# Altium schematic sheet MatrixDriver.SchDoc
size A3
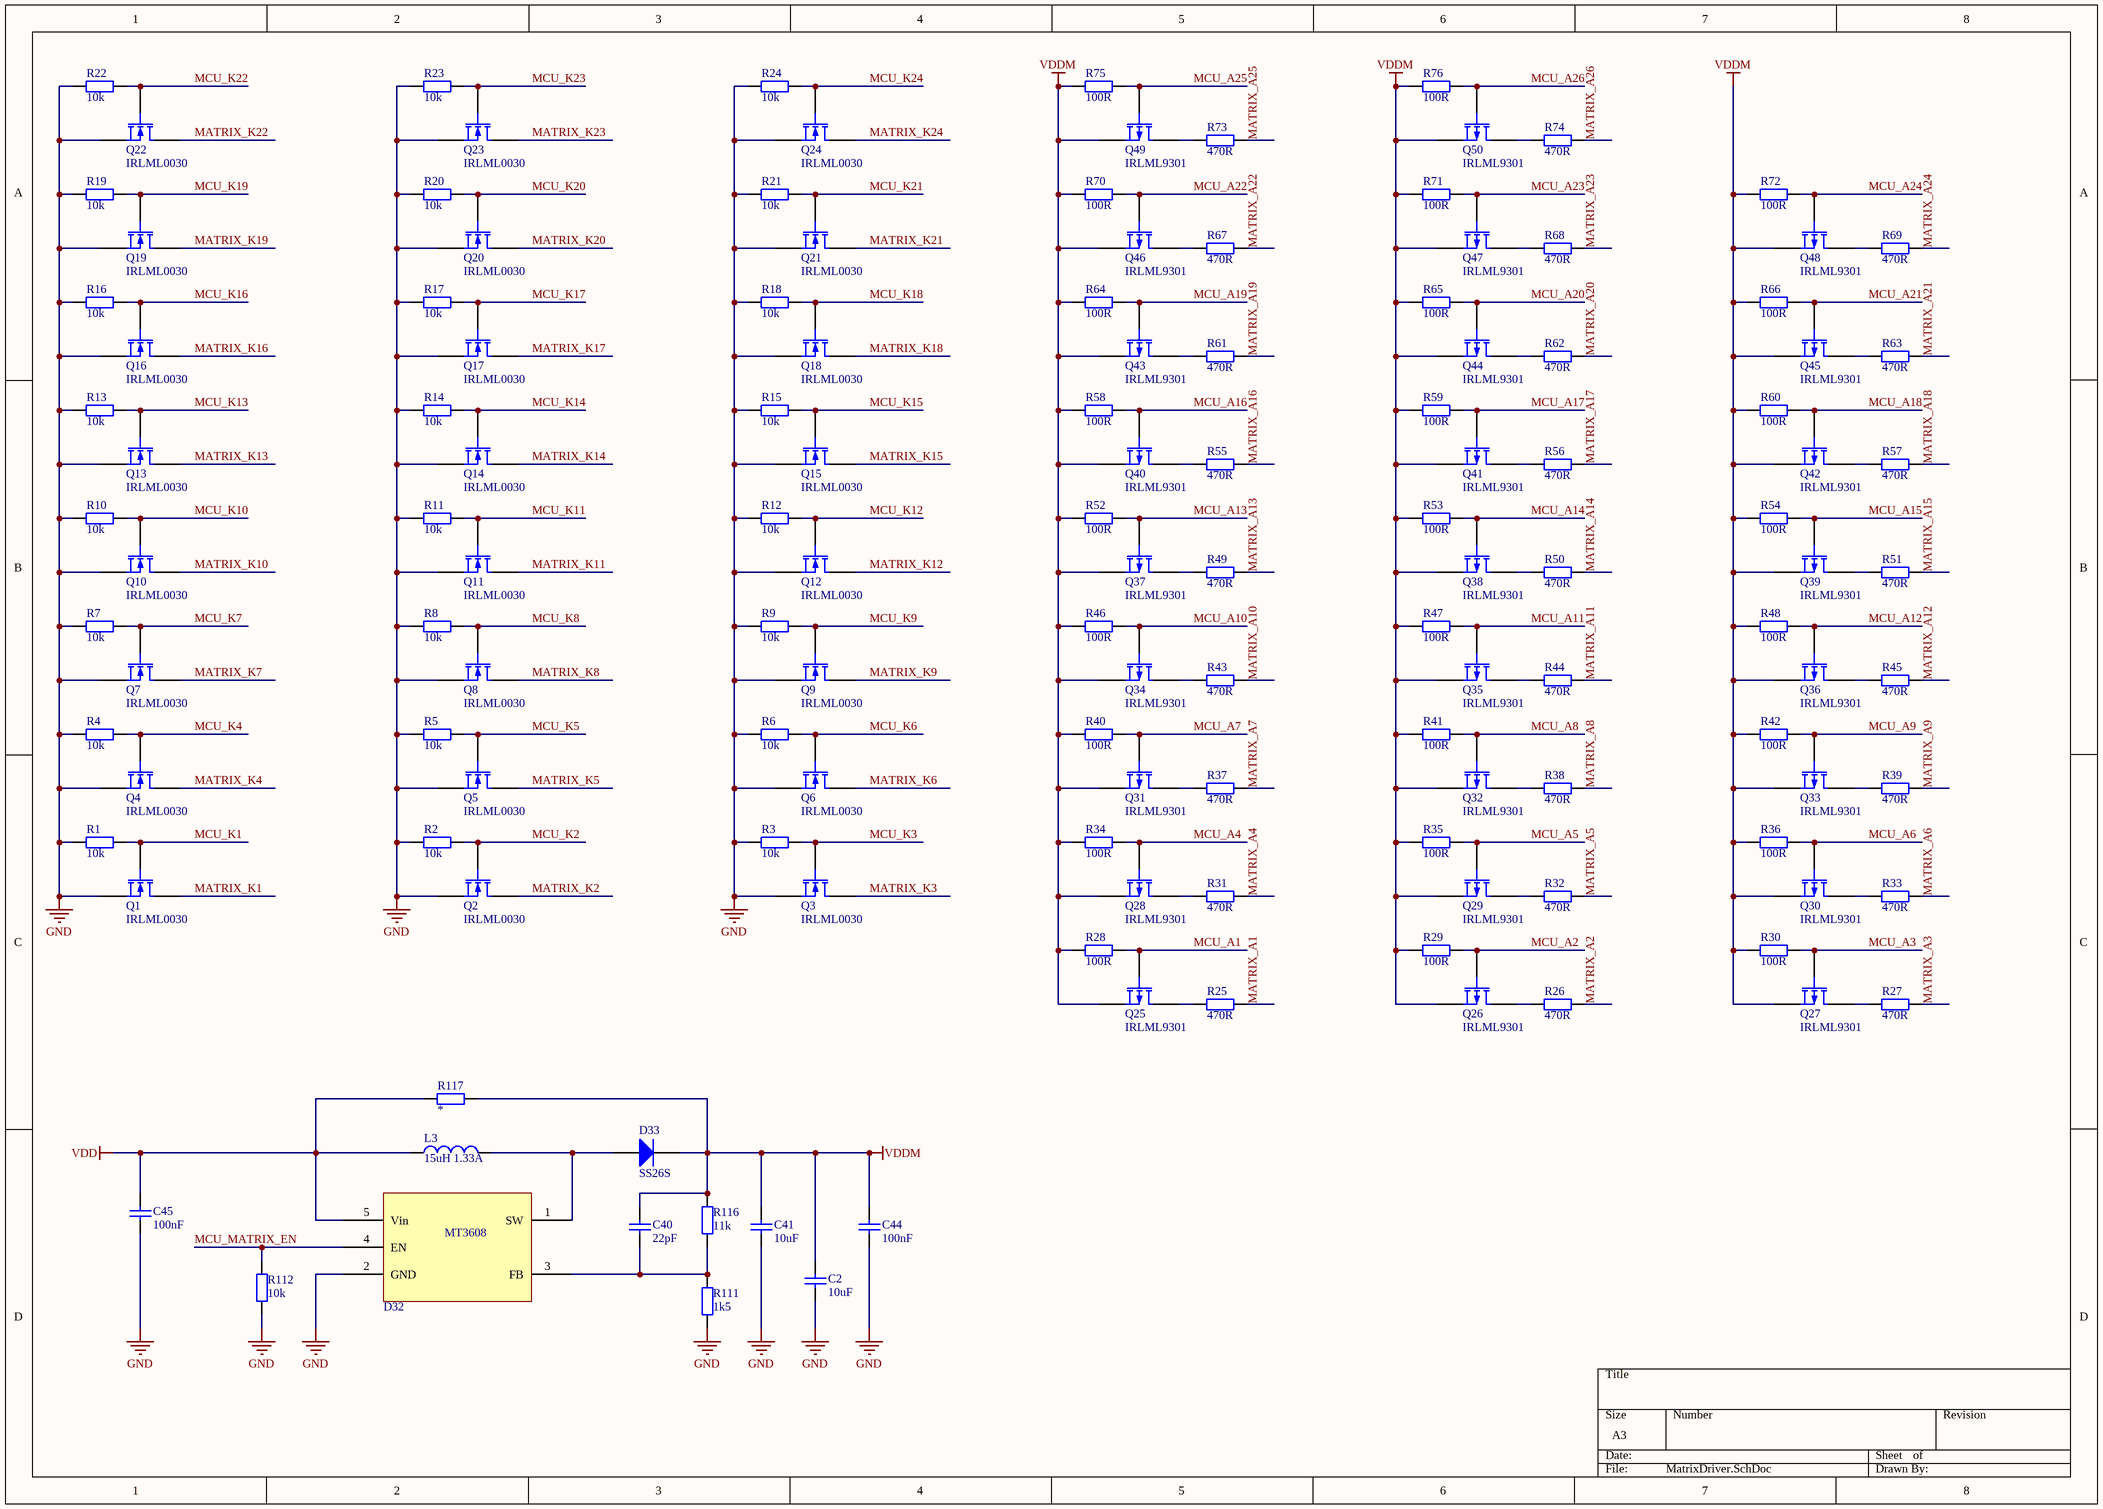
[diagram p0: MatrixDriver.SchDoc]

## Parts
C2  value 10uF  [c1206]  (hidden comment: Cap)
C40  value 22pF  [C0603]  (hidden comment: Cap)
C41  value 10uF  [c1206]  (hidden comment: Cap)
C44  value 100nF  [C0603]  (hidden comment: Cap)
C45  value 100nF  [C0603]  (hidden comment: Cap)
D32  MT3608  [SOT23-6_L]
D33  SS26S  [DO-214AB]
L3  value 15uH 1.33A  [DE0703]  (hidden comment: DE0703-15)
Q1  IRLML0030  [sot23]
Q2  IRLML0030  [sot23]
Q3  IRLML0030  [sot23]
Q4  IRLML0030  [sot23]
Q5  IRLML0030  [sot23]
Q6  IRLML0030  [sot23]
Q7  IRLML0030  [sot23]
Q8  IRLML0030  [sot23]
Q9  IRLML0030  [sot23]
Q10  IRLML0030  [sot23]
Q11  IRLML0030  [sot23]
Q12  IRLML0030  [sot23]
Q13  IRLML0030  [sot23]
Q14  IRLML0030  [sot23]
Q15  IRLML0030  [sot23]
Q16  IRLML0030  [sot23]
Q17  IRLML0030  [sot23]
Q18  IRLML0030  [sot23]
Q19  IRLML0030  [sot23]
Q20  IRLML0030  [sot23]
Q21  IRLML0030  [sot23]
Q22  IRLML0030  [sot23]
Q23  IRLML0030  [sot23]
Q24  IRLML0030  [sot23]
Q25  IRLML9301  [sot23]
Q26  IRLML9301  [sot23]
Q27  IRLML9301  [sot23]
Q28  IRLML9301  [sot23]
Q29  IRLML9301  [sot23]
Q30  IRLML9301  [sot23]
Q31  IRLML9301  [sot23]
Q32  IRLML9301  [sot23]
Q33  IRLML9301  [sot23]
Q34  IRLML9301  [sot23]
Q35  IRLML9301  [sot23]
Q36  IRLML9301  [sot23]
Q37  IRLML9301  [sot23]
Q38  IRLML9301  [sot23]
Q39  IRLML9301  [sot23]
Q40  IRLML9301  [sot23]
Q41  IRLML9301  [sot23]
Q42  IRLML9301  [sot23]
Q43  IRLML9301  [sot23]
Q44  IRLML9301  [sot23]
Q45  IRLML9301  [sot23]
Q46  IRLML9301  [sot23]
Q47  IRLML9301  [sot23]
Q48  IRLML9301  [sot23]
Q49  IRLML9301  [sot23]
Q50  IRLML9301  [sot23]
R1  value 10k  [r0603]  (hidden comment: Resistor)
R2  value 10k  [r0603]  (hidden comment: Resistor)
R3  value 10k  [r0603]  (hidden comment: Resistor)
R4  value 10k  [r0603]  (hidden comment: Resistor)
R5  value 10k  [r0603]  (hidden comment: Resistor)
R6  value 10k  [r0603]  (hidden comment: Resistor)
R7  value 10k  [r0603]  (hidden comment: Resistor)
R8  value 10k  [r0603]  (hidden comment: Resistor)
R9  value 10k  [r0603]  (hidden comment: Resistor)
R10  value 10k  [r0603]  (hidden comment: Resistor)
R11  value 10k  [r0603]  (hidden comment: Resistor)
R12  value 10k  [r0603]  (hidden comment: Resistor)
R13  value 10k  [r0603]  (hidden comment: Resistor)
R14  value 10k  [r0603]  (hidden comment: Resistor)
R15  value 10k  [r0603]  (hidden comment: Resistor)
R16  value 10k  [r0603]  (hidden comment: Resistor)
R17  value 10k  [r0603]  (hidden comment: Resistor)
R18  value 10k  [r0603]  (hidden comment: Resistor)
R19  value 10k  [r0603]  (hidden comment: Resistor)
R20  value 10k  [r0603]  (hidden comment: Resistor)
R21  value 10k  [r0603]  (hidden comment: Resistor)
R22  value 10k  [r0603]  (hidden comment: Resistor)
R23  value 10k  [r0603]  (hidden comment: Resistor)
R24  value 10k  [r0603]  (hidden comment: Resistor)
R25  value 470R  [r0603]  (hidden comment: Resistor)
R26  value 470R  [r0603]  (hidden comment: Resistor)
R27  value 470R  [r0603]  (hidden comment: Resistor)
R28  value 100R  [r0603]  (hidden comment: Resistor)
R29  value 100R  [r0603]  (hidden comment: Resistor)
R30  value 100R  [r0603]  (hidden comment: Resistor)
R31  value 470R  [r0603]  (hidden comment: Resistor)
R32  value 470R  [r0603]  (hidden comment: Resistor)
R33  value 470R  [r0603]  (hidden comment: Resistor)
R34  value 100R  [r0603]  (hidden comment: Resistor)
R35  value 100R  [r0603]  (hidden comment: Resistor)
R36  value 100R  [r0603]  (hidden comment: Resistor)
R37  value 470R  [r0603]  (hidden comment: Resistor)
R38  value 470R  [r0603]  (hidden comment: Resistor)
R39  value 470R  [r0603]  (hidden comment: Resistor)
R40  value 100R  [r0603]  (hidden comment: Resistor)
R41  value 100R  [r0603]  (hidden comment: Resistor)
R42  value 100R  [r0603]  (hidden comment: Resistor)
R43  value 470R  [r0603]  (hidden comment: Resistor)
R44  value 470R  [r0603]  (hidden comment: Resistor)
R45  value 470R  [r0603]  (hidden comment: Resistor)
R46  value 100R  [r0603]  (hidden comment: Resistor)
R47  value 100R  [r0603]  (hidden comment: Resistor)
R48  value 100R  [r0603]  (hidden comment: Resistor)
R49  value 470R  [r0603]  (hidden comment: Resistor)
R50  value 470R  [r0603]  (hidden comment: Resistor)
R51  value 470R  [r0603]  (hidden comment: Resistor)
R52  value 100R  [r0603]  (hidden comment: Resistor)
R53  value 100R  [r0603]  (hidden comment: Resistor)
R54  value 100R  [r0603]  (hidden comment: Resistor)
R55  value 470R  [r0603]  (hidden comment: Resistor)
R56  value 470R  [r0603]  (hidden comment: Resistor)
R57  value 470R  [r0603]  (hidden comment: Resistor)
R58  value 100R  [r0603]  (hidden comment: Resistor)
R59  value 100R  [r0603]  (hidden comment: Resistor)
R60  value 100R  [r0603]  (hidden comment: Resistor)
R61  value 470R  [r0603]  (hidden comment: Resistor)
R62  value 470R  [r0603]  (hidden comment: Resistor)
R63  value 470R  [r0603]  (hidden comment: Resistor)
R64  value 100R  [r0603]  (hidden comment: Resistor)
R65  value 100R  [r0603]  (hidden comment: Resistor)
R66  value 100R  [r0603]  (hidden comment: Resistor)
R67  value 470R  [r0603]  (hidden comment: Resistor)
R68  value 470R  [r0603]  (hidden comment: Resistor)
R69  value 470R  [r0603]  (hidden comment: Resistor)
R70  value 100R  [r0603]  (hidden comment: Resistor)
R71  value 100R  [r0603]  (hidden comment: Resistor)
R72  value 100R  [r0603]  (hidden comment: Resistor)
R73  value 470R  [r0603]  (hidden comment: Resistor)
R74  value 470R  [r0603]  (hidden comment: Resistor)
R75  value 100R  [r0603]  (hidden comment: Resistor)
R76  value 100R  [r0603]  (hidden comment: Resistor)
R111  value 1k5  [r0603]  (hidden comment: Resistor)
R112  value 10k  [r0603]  (hidden comment: Resistor)
R116  value 11k  [r0603]  (hidden comment: Resistor)
R117  Resistor  [n0603]  (value not drawn)

## Nets
GND: C2.1 C41.1 C44.1 C45.1 D32.2(GND) Q1.2(S) Q2.2(S) Q3.2(S) Q4.2(S) Q5.2(S) Q6.2(S) Q7.2(S) Q8.2(S) Q9.2(S) Q10.2(S) Q11.2(S) Q12.2(S) Q13.2(S) Q14.2(S) Q15.2(S) Q16.2(S) Q17.2(S) Q18.2(S) Q19.2(S) Q20.2(S) Q21.2(S) Q22.2(S) Q23.2(S) Q24.2(S) R1.1 R2.1 R3.1 R4.1 R5.1 R6.1 R7.1 R8.1 R9.1 R10.1 R11.1 R12.1 R13.1 R14.1 R15.1 R16.1 R17.1 R18.1 R19.1 R20.1 R21.1 R22.1 R23.1 R24.1 R111.1 R112.1
VDD: C45.2 D32.5(Vin) L3.1 R117.2
VDDM: C2.2 C40.2 C41.2 C44.2 D33.2(K) Q25.2(S) Q26.2(S) Q27.2(S) Q28.2(S) Q29.2(S) Q30.2(S) Q31.2(S) Q32.2(S) Q33.2(S) Q34.2(S) Q35.2(S) Q36.2(S) Q37.2(S) Q38.2(S) Q39.2(S) Q40.2(S) Q41.2(S) Q42.2(S) Q43.2(S) Q44.2(S) Q45.2(S) Q46.2(S) Q47.2(S) Q48.2(S) Q49.2(S) Q50.2(S) R28.1 R29.1 R30.1 R34.1 R35.1 R36.1 R40.1 R41.1 R42.1 R46.1 R47.1 R48.1 R52.1 R53.1 R54.1 R58.1 R59.1 R60.1 R64.1 R65.1 R66.1 R70.1 R71.1 R72.1 R75.1 R76.1 R116.2 R117.1
MATRIX_A1: R25.2
MATRIX_A2: R26.2
MATRIX_A3: R27.2
MATRIX_A4: R31.2
MATRIX_A5: R32.2
MATRIX_A6: R33.2
MATRIX_A7: R37.2
MATRIX_A8: R38.2
MATRIX_A9: R39.2
MATRIX_A10: R43.2
MATRIX_A11: R44.2
MATRIX_A12: R45.2
MATRIX_A13: R49.2
MATRIX_A14: R50.2
MATRIX_A15: R51.2
MATRIX_A16: R55.2
MATRIX_A17: R56.2
MATRIX_A18: R57.2
MATRIX_A19: R61.2
MATRIX_A20: R62.2
MATRIX_A21: R63.2
MATRIX_A22: R67.2
MATRIX_A23: R68.2
MATRIX_A24: R69.2
MATRIX_A25: R73.2
MATRIX_A26: R74.2
MATRIX_K1: Q1.3(D)
MATRIX_K2: Q2.3(D)
MATRIX_K3: Q3.3(D)
MATRIX_K4: Q4.3(D)
MATRIX_K5: Q5.3(D)
MATRIX_K6: Q6.3(D)
MATRIX_K7: Q7.3(D)
MATRIX_K8: Q8.3(D)
MATRIX_K9: Q9.3(D)
MATRIX_K10: Q10.3(D)
MATRIX_K11: Q11.3(D)
MATRIX_K12: Q12.3(D)
MATRIX_K13: Q13.3(D)
MATRIX_K14: Q14.3(D)
MATRIX_K15: Q15.3(D)
MATRIX_K16: Q16.3(D)
MATRIX_K17: Q17.3(D)
MATRIX_K18: Q18.3(D)
MATRIX_K19: Q19.3(D)
MATRIX_K20: Q20.3(D)
MATRIX_K21: Q21.3(D)
MATRIX_K22: Q22.3(D)
MATRIX_K23: Q23.3(D)
MATRIX_K24: Q24.3(D)
MCU_A1: Q25.1(G) R28.2
MCU_A2: Q26.1(G) R29.2
MCU_A3: Q27.1(G) R30.2
MCU_A4: Q28.1(G) R34.2
MCU_A5: Q29.1(G) R35.2
MCU_A6: Q30.1(G) R36.2
MCU_A7: Q31.1(G) R40.2
MCU_A8: Q32.1(G) R41.2
MCU_A9: Q33.1(G) R42.2
MCU_A10: Q34.1(G) R46.2
MCU_A11: Q35.1(G) R47.2
MCU_A12: Q36.1(G) R48.2
MCU_A13: Q37.1(G) R52.2
MCU_A14: Q38.1(G) R53.2
MCU_A15: Q39.1(G) R54.2
MCU_A16: Q40.1(G) R58.2
MCU_A17: Q41.1(G) R59.2
MCU_A18: Q42.1(G) R60.2
MCU_A19: Q43.1(G) R64.2
MCU_A20: Q44.1(G) R65.2
MCU_A21: Q45.1(G) R66.2
MCU_A22: Q46.1(G) R70.2
MCU_A23: Q47.1(G) R71.2
MCU_A24: Q48.1(G) R72.2
MCU_A25: Q49.1(G) R75.2
MCU_A26: Q50.1(G) R76.2
MCU_K1: Q1.1(G) R1.2
MCU_K2: Q2.1(G) R2.2
MCU_K3: Q3.1(G) R3.2
MCU_K4: Q4.1(G) R4.2
MCU_K5: Q5.1(G) R5.2
MCU_K6: Q6.1(G) R6.2
MCU_K7: Q7.1(G) R7.2
MCU_K8: Q8.1(G) R8.2
MCU_K9: Q9.1(G) R9.2
MCU_K10: Q10.1(G) R10.2
MCU_K11: Q11.1(G) R11.2
MCU_K12: Q12.1(G) R12.2
MCU_K13: Q13.1(G) R13.2
MCU_K14: Q14.1(G) R14.2
MCU_K15: Q15.1(G) R15.2
MCU_K16: Q16.1(G) R16.2
MCU_K17: Q17.1(G) R17.2
MCU_K18: Q18.1(G) R18.2
MCU_K19: Q19.1(G) R19.2
MCU_K20: Q20.1(G) R20.2
MCU_K21: Q21.1(G) R21.2
MCU_K22: Q22.1(G) R22.2
MCU_K23: Q23.1(G) R23.2
MCU_K24: Q24.1(G) R24.2
MCU_MATRIX_EN: D32.4(EN) R112.2
NetC40_1: C40.1 D32.3(FB) R111.2 R116.1
NetD32_1: D32.1(SW) D33.1(A) L3.2
NetQ25_3: Q25.3(D) R25.1
NetQ26_3: Q26.3(D) R26.1
NetQ27_3: Q27.3(D) R27.1
NetQ28_3: Q28.3(D) R31.1
NetQ29_3: Q29.3(D) R32.1
NetQ30_3: Q30.3(D) R33.1
NetQ31_3: Q31.3(D) R37.1
NetQ32_3: Q32.3(D) R38.1
NetQ33_3: Q33.3(D) R39.1
NetQ34_3: Q34.3(D) R43.1
NetQ35_3: Q35.3(D) R44.1
NetQ36_3: Q36.3(D) R45.1
NetQ37_3: Q37.3(D) R49.1
NetQ38_3: Q38.3(D) R50.1
NetQ39_3: Q39.3(D) R51.1
NetQ40_3: Q40.3(D) R55.1
NetQ41_3: Q41.3(D) R56.1
NetQ42_3: Q42.3(D) R57.1
NetQ43_3: Q43.3(D) R61.1
NetQ44_3: Q44.3(D) R62.1
NetQ45_3: Q45.3(D) R63.1
NetQ46_3: Q46.3(D) R67.1
NetQ47_3: Q47.3(D) R68.1
NetQ48_3: Q48.3(D) R69.1
NetQ49_3: Q49.3(D) R73.1
NetQ50_3: Q50.3(D) R74.1

## Library data of the parts
C2 C40 C41 C44 C45 = Cap: Capacitor; Published: 8-Jun-2000; LatestRevisionDate: 17-Jul-2002; LatestRevisionNote: Re-released for DXP Platform.; PackageReference: RAD-0.3; Publisher: Altium Limited; PackageDescription: Radial Cap, Thru-Hole; 2 Leads; 0.3 in Pin Spacing
D33 = Diode: Default Diode; Published: 8-Jun-2000; LatestRevisionDate: 17-Jul-2002; LatestRevisionNote: Re-released for DXP Platform.; PackageVersion: Sep-1996; PackageReference: SMC; Publisher: Altium Limited; PackageDescription: DO-214-AB/SMC; 2 C-Bend Leads; Body 7.9 x 5.9 mm, inc. leads (LxW); Code_JEDEC: DO-214-AB
L3 = Inductor: Code_IEC: 1005; Published: 8-Jun-2000; LatestRevisionDate: 29-May-2009; LatestRevisionNote: IPC-7351 Footprint Added.; PackageReference: 0402-A; Publisher: Altium Limited; PackageDescription: Chip Inductor; Code_JEITA: 0402
Q1-Q24 = MOSFET-N: N-Channel MOSFET; Published: 8-Jun-2000; LatestRevisionDate: 17-Jul-2002; LatestRevisionNote: Re-released for DXP Platform.; PackageVersion: 1995/1996; PackageReference: E3; Publisher: Altium Limited; PackageDescription: TO, Flat Index; 3 In-Line, Axial Leads; Body Dia. 4.6mm; Lead Dia. 0.5 mm (max)
Q25-Q50 = MOSFET-P: P-Channel MOSFET; Published: 8-Jun-2000; LatestRevisionDate: 17-Jul-2002; LatestRevisionNote: Re-released for DXP Platform.; PackageVersion: 1995/1996; PackageReference: E3; Publisher: Altium Limited; PackageDescription: TO, Flat Index; 3 In-Line, Axial Leads; Body Dia. 4.6mm; Lead Dia. 0.5 mm (max)
R1-R76 R111 R112 R116 R117 = Resistor: Published: 8-Jun-2000; LatestRevisionDate: 17-Jul-2002; LatestRevisionNote: Re-released for DXP Platform.; PackageReference: AXIAL-0.4; Publisher: Altium Limited; PackageDescription: Axial Device, Thru-Hole; 2 Leads; 0.4 in Pin Spacing
  R117: Value: *